# Altium schematic sheet BoardDiagramEntryConn.SchDoc: Board Diagram Entry Connection
size A3; Author: NeoExiZ; CompanyName: BUPT CPS Lab; Engineer: NeoExiZ; Organization: NeoExiZ; Address1: 418, 4#Building,BUPT; Address2: No.10, Xitucheng Road; Address3: Beijing; Address4: China
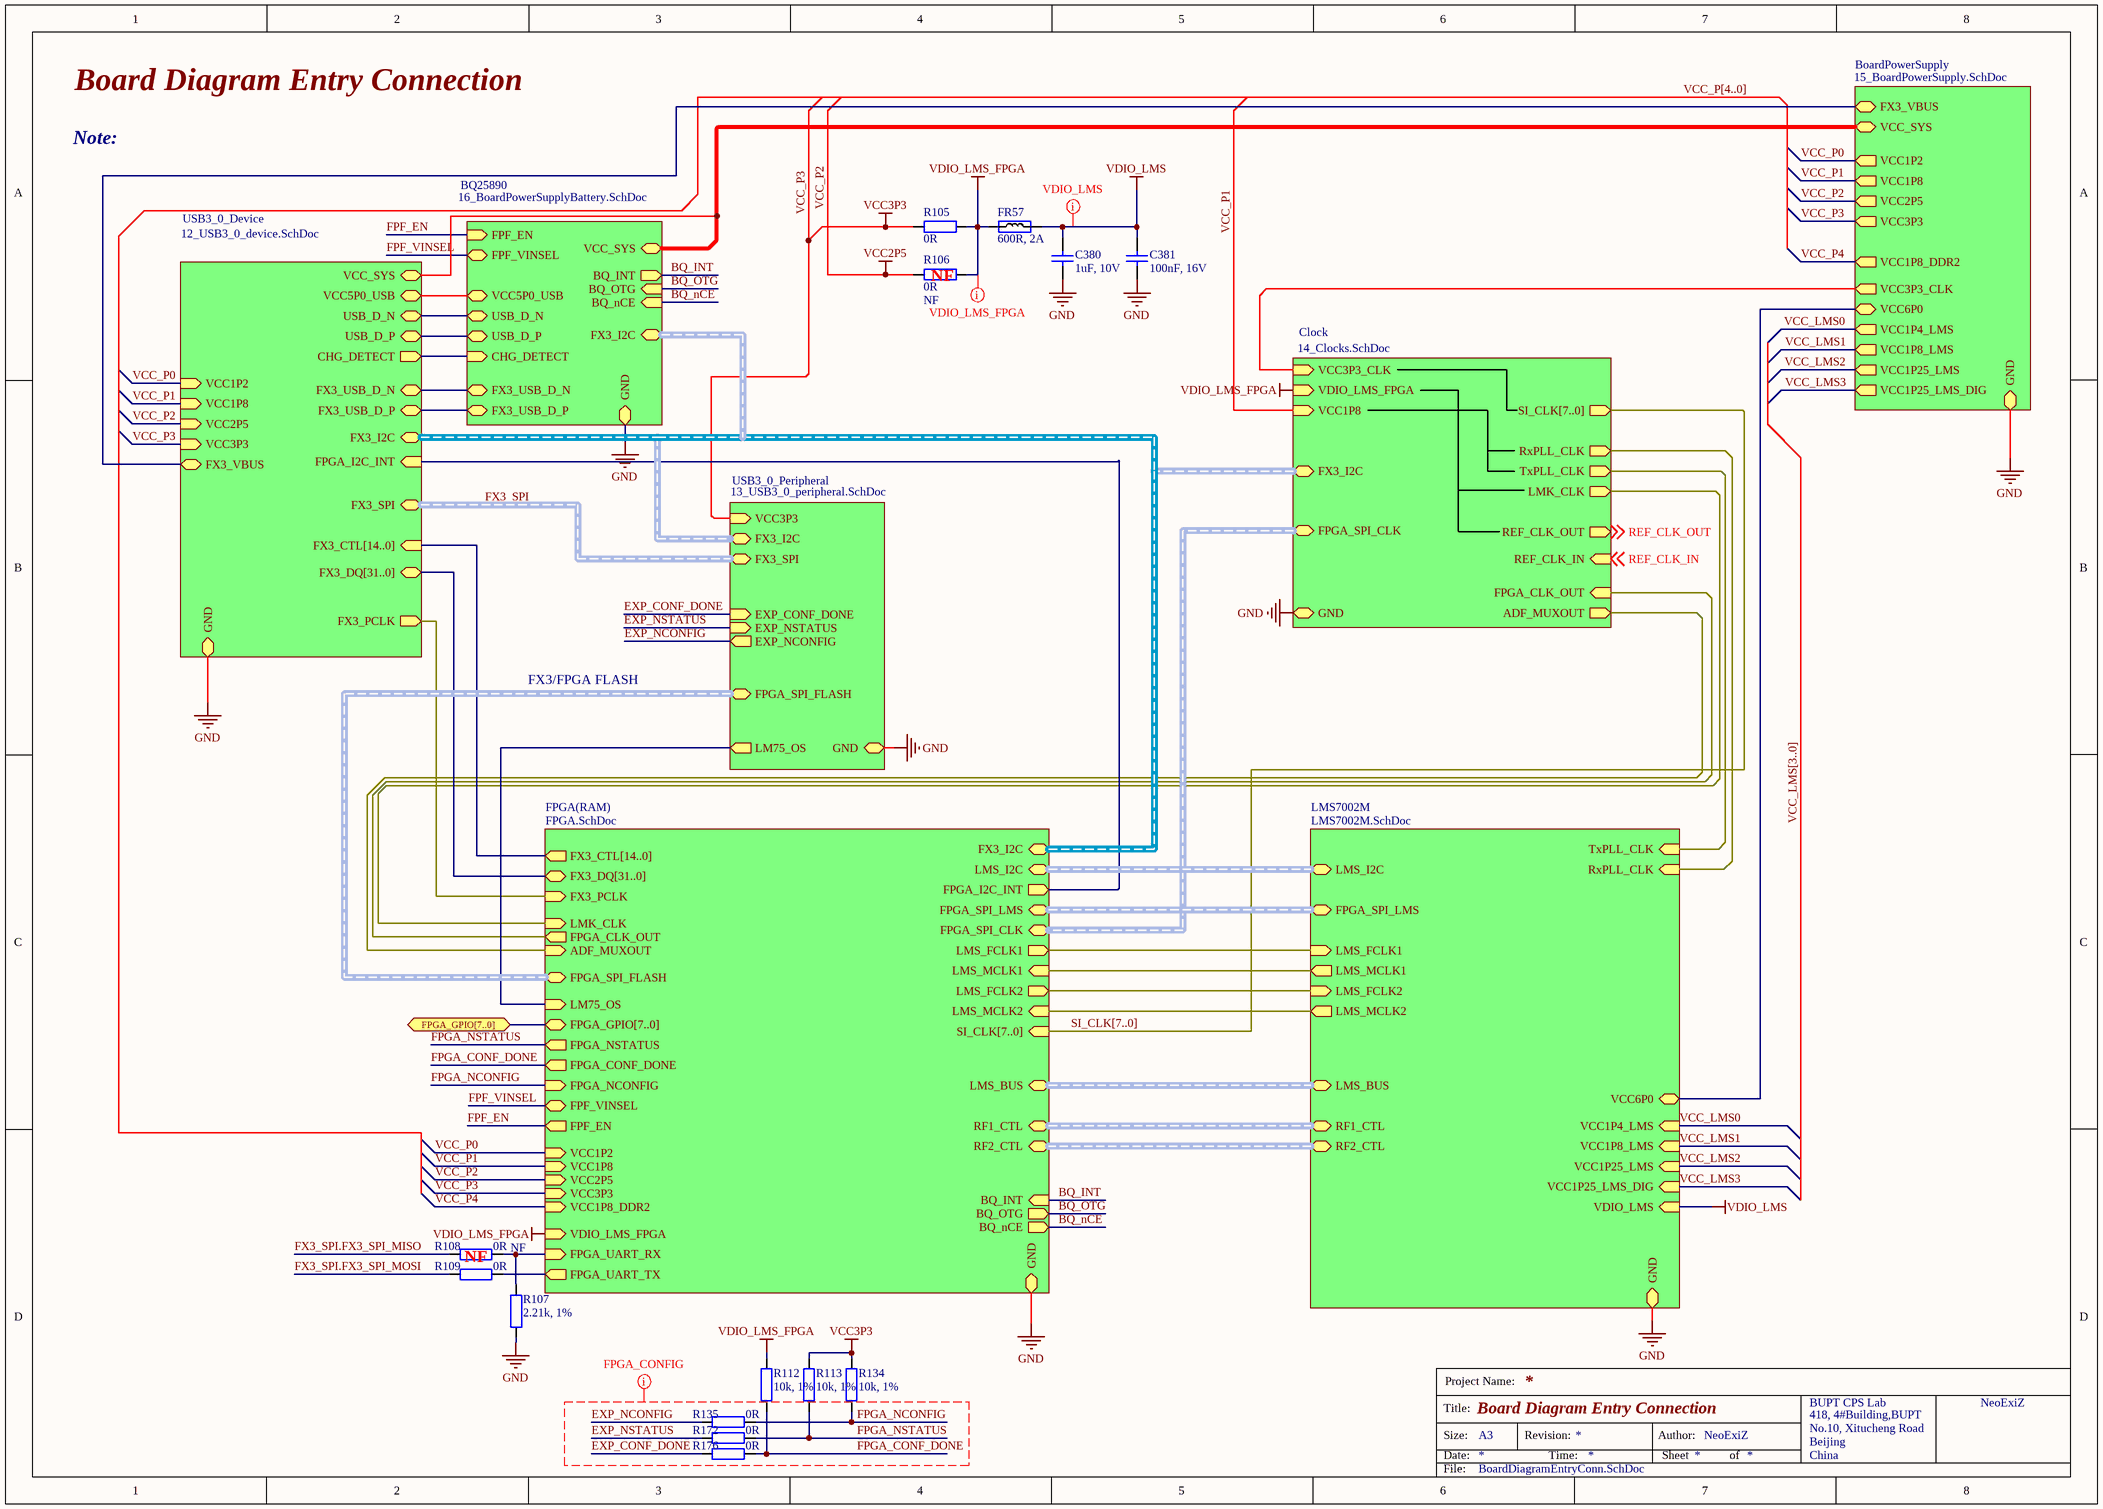
[diagram p0: BoardDiagramEntryConn.SchDoc]

## Parts
C380  1uF, 10V  [CAP0402]
C381  100nF, 16V  [CAP0402]
FR57  600R, 2A  [RES0805]
R105  0R  [RES0402]
R106  0R  Assembly Info: NF  [RES0402]
R107  2.21k, 1%  [RES0402]
R108  0R  Assembly Info: NF  [RES0402]
R109  0R  [RES0402]
R112  10k, 1%  [RES0402]
R113  10k, 1%  [RES0402]
R134  10k, 1%  [RES0402]
R135  0R  [RES0402]
R172  0R  [RES0402]
R176  0R  [RES0402]

## Sub-sheets
BoardPowerSupply = 15_BoardPowerSupply.SchDoc: VCC3P3 (out), VCC2P5 (out), VCC1P2 (out), VCC3P3_CLK (out), VCC1P4_LMS (out), VCC1P8_LMS (out), VCC1P25_LMS (out), VCC1P25_LMS_DIG (out), VCC1P8 (out), VCC1P8_DDR2 (out), VCC_SYS, GND, FX3_VBUS, VCC6P0
BQ25890 = 16_BoardPowerSupplyBattery.SchDoc: VCC5P0_USB, FX3_USB_D_N (bidir), FX3_USB_D_P (bidir), USB_D_N (bidir), USB_D_P (bidir), VCC_SYS, FPF_VINSEL (bidir), GND, BQ_nCE (in), BQ_INT (out), BQ_OTG (in), CHG_DETECT (in), FPF_EN (in), FX3_I2C (harness FX3_I2C)
Clock = 14_Clocks.SchDoc: VDIO_LMS_FPGA (in), VCC3P3_CLK (in), VCC1P8 (in), REF_CLK_IN (in), REF_CLK_OUT (out), SI_CLK[7..0] (out), RxPLL_CLK (out), TxPLL_CLK (out), FPGA_CLK_OUT (in), LMK_CLK (out), ADF_MUXOUT (out), GND, FPGA_SPI_CLK (harness FPGA_SPI_CLK), FX3_I2C (harness FX3_I2C)
FPGA(RAM) = FPGA.SchDoc: SI_CLK[7..0] (in), FX3_DQ[31..0] (bidir), FX3_PCLK (in), FX3_CTL[14..0] (out, harness FX3_SPI), LMS_MCLK1 (in), LMS_MCLK2 (in), FPGA_NSTATUS (out), FPGA_CONF_DONE (out), FPGA_NCONFIG (in), LMS_FCLK1 (out), LMS_FCLK2 (out), FPGA_I2C_INT (out), LMK_CLK (in), FPGA_CLK_OUT (out), LM75_OS (in), FPGA_GPIO[7..0] (bidir), VCC1P2 (in), VCC1P8 (in), VCC3P3 (in), VDIO_LMS_FPGA (in), VCC2P5 (in), FPGA_UART_RX (in), FPGA_UART_TX (out), ADF_MUXOUT (in), VCC1P8_DDR2 (in), FPF_VINSEL (bidir), GND, BQ_INT (in), BQ_OTG (out), BQ_nCE (out), FPF_EN (out), FPGA_SPI_CLK (harness FPGA_SPI_CLK), FX3_I2C (harness FX3_I2C), FPGA_SPI_FLASH (harness FPGA_SPI_FLASH), FPGA_SPI_LMS (harness FPGA_SPI_LMS), LMS_I2C (harness I2C), LMS_BUS (harness LMS_BUS), RF1_CTL (harness RF_CTL), RF2_CTL (harness RF_CTL)
LMS7002M = LMS7002M.SchDoc: FPGA_SPI_LMS (harness FPGA_SPI_LMS), LMS_FCLK1 (in), LMS_FCLK2 (in), LMS_MCLK1 (out), LMS_MCLK2 (out), RxPLL_CLK (in), TxPLL_CLK (in), VCC1P4_LMS (in), VCC1P8_LMS (in), VCC1P25_LMS (in), VCC1P25_LMS_DIG (in), VDIO_LMS (in), GND, LMS_I2C (harness I2C), LMS_BUS (harness LMS_BUS), RF1_CTL (harness RF_CTL), RF2_CTL (harness RF_CTL), VCC6P0
USB3_0_Device = 12_USB3_0_device.SchDoc: VCC1P2 (in), VCC1P8 (in), VCC2P5 (in), VCC3P3 (in), FX3_CTL[14..0] (in, harness FX3_SPI), FX3_DQ[31..0] (bidir), FX3_PCLK (out), FX3_USB_D_N (bidir), FX3_USB_D_P (bidir), VCC5P0_USB, USB_D_N (bidir), USB_D_P (bidir), GND, VCC_SYS, CHG_DETECT (out), FPGA_I2C_INT (in), FX3_I2C (harness FX3_I2C), FX3_SPI (harness FX3_SPI), FX3_VBUS
USB3_0_Peripheral = 13_USB3_0_peripheral.SchDoc: EXP_NCONFIG (out), EXP_NSTATUS (in), EXP_CONF_DONE (in), LM75_OS (out), VCC3P3 (in), GND, FX3_I2C (harness FX3_I2C), FPGA_SPI_FLASH (harness FPGA_SPI_FLASH), FX3_SPI (harness FX3_SPI)

## Ports
FPGA_GPIO[7..0] (bidir)

## Nets
GND: C380.1 C381.2 R107.1 ; sheet BoardPowerSupply/GND, sheet BQ25890/GND, sheet Clock/GND, sheet USB3_0_Device/GND, sheet USB3_0_Peripheral/GND, sheet FPGA(RAM)/GND, sheet LMS7002M/GND
VCC_P2: R106.2 ; sheet BoardPowerSupply/VCC2P5, sheet USB3_0_Device/VCC2P5, sheet FPGA(RAM)/VCC2P5  [also labelled VCC2P5]
VCC_P3: R105.2 R113.1 R134.1 ; sheet BoardPowerSupply/VCC3P3, sheet USB3_0_Device/VCC3P3, sheet USB3_0_Peripheral/VCC3P3, sheet FPGA(RAM)/VCC3P3  [also labelled VCC3P3]
VDIO_LMS: C380.2 C381.1 FR57.2 ; sheet LMS7002M/VDIO_LMS
VDIO_LMS_FPGA: FR57.1 R105.1 R106.1 R112.1 ; sheet Clock/VDIO_LMS_FPGA, sheet FPGA(RAM)/VDIO_LMS_FPGA
BQ_INT: sheet BQ25890/BQ_INT, sheet FPGA(RAM)/BQ_INT
BQ_nCE: sheet BQ25890/BQ_nCE, sheet FPGA(RAM)/BQ_nCE
BQ_OTG: sheet BQ25890/BQ_OTG, sheet FPGA(RAM)/BQ_OTG
EXP_CONF_DONE: R176.1 ; sheet USB3_0_Peripheral/EXP_CONF_DONE
EXP_NCONFIG: R135.1 ; sheet USB3_0_Peripheral/EXP_NCONFIG
EXP_NSTATUS: R172.1 ; sheet USB3_0_Peripheral/EXP_NSTATUS
FPF_EN: sheet BQ25890/FPF_EN, sheet FPGA(RAM)/FPF_EN
FPF_VINSEL: sheet BQ25890/FPF_VINSEL, sheet FPGA(RAM)/FPF_VINSEL
FPGA_CONF_DONE: R112.2 R176.2 ; sheet FPGA(RAM)/FPGA_CONF_DONE
FPGA_NCONFIG: R134.2 R135.2 ; sheet FPGA(RAM)/FPGA_NCONFIG
FPGA_NSTATUS: R113.2 R172.2 ; sheet FPGA(RAM)/FPGA_NSTATUS
FX3_SPI.FX3_SPI_MISO: R108.1
FX3_SPI.FX3_SPI_MOSI: R109.1
REF_CLK_IN: off-sheet REF_CLK_IN, sheet Clock/REF_CLK_IN
REF_CLK_OUT: off-sheet REF_CLK_OUT, sheet Clock/REF_CLK_OUT
VCC_LMS0: sheet BoardPowerSupply/VCC1P4_LMS, sheet LMS7002M/VCC1P4_LMS
VCC_LMS1: sheet BoardPowerSupply/VCC1P8_LMS, sheet LMS7002M/VCC1P8_LMS
VCC_LMS2: sheet BoardPowerSupply/VCC1P25_LMS, sheet LMS7002M/VCC1P25_LMS
VCC_LMS3: sheet BoardPowerSupply/VCC1P25_LMS_DIG, sheet LMS7002M/VCC1P25_LMS_DIG
VCC_P0: sheet BoardPowerSupply/VCC1P2, sheet USB3_0_Device/VCC1P2, sheet FPGA(RAM)/VCC1P2
VCC_P1: sheet BoardPowerSupply/VCC1P8, sheet Clock/VCC1P8, sheet USB3_0_Device/VCC1P8, sheet FPGA(RAM)/VCC1P8
VCC_P4: sheet BoardPowerSupply/VCC1P8_DDR2, sheet FPGA(RAM)/VCC1P8_DDR2
NetR107_2: R107.2 R108.2 ; sheet FPGA(RAM)/FPGA_UART_RX
NetR109_2: R109.2 ; sheet FPGA(RAM)/FPGA_UART_TX
(unnamed): sheet BoardPowerSupply/VCC3P3_CLK, sheet Clock/VCC3P3_CLK
(unnamed): sheet BoardPowerSupply/VCC_SYS, sheet BQ25890/VCC_SYS, sheet USB3_0_Device/VCC_SYS
(unnamed): sheet BoardPowerSupply/FX3_VBUS, sheet USB3_0_Device/FX3_VBUS
(unnamed): sheet BoardPowerSupply/VCC6P0, sheet LMS7002M/VCC6P0
(unnamed): sheet BQ25890/VCC5P0_USB, sheet USB3_0_Device/VCC5P0_USB
(unnamed): sheet BQ25890/FX3_USB_D_N, sheet USB3_0_Device/FX3_USB_D_N
(unnamed): sheet BQ25890/FX3_USB_D_P, sheet USB3_0_Device/FX3_USB_D_P
(unnamed): sheet BQ25890/USB_D_N, sheet USB3_0_Device/USB_D_N
(unnamed): sheet BQ25890/USB_D_P, sheet USB3_0_Device/USB_D_P
(unnamed): sheet BQ25890/CHG_DETECT, sheet USB3_0_Device/CHG_DETECT
(unnamed): sheet Clock/RxPLL_CLK, sheet LMS7002M/RxPLL_CLK
(unnamed): sheet Clock/TxPLL_CLK, sheet LMS7002M/TxPLL_CLK
(unnamed): sheet Clock/FPGA_CLK_OUT, sheet FPGA(RAM)/FPGA_CLK_OUT
(unnamed): sheet Clock/LMK_CLK, sheet FPGA(RAM)/LMK_CLK
(unnamed): sheet Clock/ADF_MUXOUT, sheet FPGA(RAM)/ADF_MUXOUT
(unnamed): sheet USB3_0_Device/FX3_PCLK, sheet FPGA(RAM)/FX3_PCLK
(unnamed): sheet USB3_0_Device/FPGA_I2C_INT, sheet FPGA(RAM)/FPGA_I2C_INT
(unnamed): sheet USB3_0_Peripheral/LM75_OS, sheet FPGA(RAM)/LM75_OS
(unnamed): sheet FPGA(RAM)/LMS_MCLK1, sheet LMS7002M/LMS_MCLK1
(unnamed): sheet FPGA(RAM)/LMS_MCLK2, sheet LMS7002M/LMS_MCLK2
(unnamed): sheet FPGA(RAM)/LMS_FCLK1, sheet LMS7002M/LMS_FCLK1
(unnamed): sheet FPGA(RAM)/LMS_FCLK2, sheet LMS7002M/LMS_FCLK2

## Buses and harness runs
bus port FPGA_GPIO[7..0] = sheet FPGA(RAM)/FPGA_GPIO[7..0]
bus sheet FPGA(RAM)/FX3_DQ[31..0] = sheet USB3_0_Device/FX3_DQ[31..0]
bus SI_CLK[7..0] = sheet Clock/SI_CLK[7..0] = sheet FPGA(RAM)/SI_CLK[7..0]
bus VCC_LMS[3..0]
bus VCC_P[4..0]
harness FX3_SPI = sheet USB3_0_Device/FX3_SPI = sheet USB3_0_Peripheral/FX3_SPI
harness sheet BQ25890/FX3_I2C = sheet Clock/FX3_I2C = sheet FPGA(RAM)/FX3_I2C = sheet USB3_0_Device/FX3_I2C = sheet USB3_0_Peripheral/FX3_I2C
harness sheet Clock/FPGA_SPI_CLK = sheet FPGA(RAM)/FPGA_SPI_CLK
harness sheet FPGA(RAM)/FPGA_SPI_FLASH = sheet USB3_0_Peripheral/FPGA_SPI_FLASH
harness sheet FPGA(RAM)/FPGA_SPI_LMS = sheet LMS7002M/FPGA_SPI_LMS
harness sheet FPGA(RAM)/LMS_BUS = sheet LMS7002M/LMS_BUS
harness sheet FPGA(RAM)/LMS_I2C = sheet LMS7002M/LMS_I2C
harness sheet FPGA(RAM)/RF1_CTL = sheet LMS7002M/RF1_CTL
harness sheet FPGA(RAM)/RF2_CTL = sheet LMS7002M/RF2_CTL

## Layout directives
net class FPGA_CONFIG: EXP_CONF_DONE, EXP_NCONFIG, EXP_NSTATUS, FPGA_CONF_DONE, FPGA_NCONFIG, FPGA_NSTATUS
net class VDIO_LMS: VDIO_LMS
net class VDIO_LMS_FPGA: VDIO_LMS_FPGA

## Notes on the sheet
- (near R106) NF
- FX3/FPGA FLASH
- (near R108) NF
- Note:
- Project Name:
- Size:
- Date:
- Title:
- A3
- Revision:
- Time:
- Author:
- Sheet
- of
- File:

## Library data of the parts
C380 = Cap_0402: Manufacturer Part Number 1: GRM155R61A105KE15J; Manufacturer: TDK; Part Description: 1µF ±10% 10V X5R Ceramic Capacitor -55°C ~ 85°C Surface Mount, MLCC 0402 (1005 Metric) 0.039" L x 0.020" W (1.00mm x 0.50mm); Voltage Rating: 10; Capacitance Tolerance: ± 10%; Product Range: TDK - C Series; Ceramic Capacitor Case: 0402 [1005 Metric]; Capacitance: 1; Dielectric Characteristic: X6; Value: 1uF, 10V; Supplier 1: Newark; Supplier Part Number 1: 490-6298-2-ND; MSL: -; RoHS: YES
C381 = Cap_0402: Manufacturer: Murata Electronics; Manufacturer Part Number: GRM155R71C104KA88D; Part Description: 0.10µF ±10% 16V X7R Ceramic Capacitor -55°C ~ 125°C Surface Mount, MLCC 0402 (1005 Metric) 0.039" L x 0.020" W (1.00mm x 0.50mm); Tolerance: 10 %; Type: General Purpose MLCC; Capacitance: 0.1 uF; Case Length: 1 mm; Dielectric: X7R; Case Height: 0.5 mm; Temperature Coefficient / Code: +/- 15 %; Value: 100nF, 16V; Supplier 1: Mouser; Supplier Part Number 1: 81-GRM155R71C104KA88; Case Code - in: 0402; RoHS: RoHS Compliant; Operating Temperature Range: - 55 C to + 125 C; Series: GRM; Termination Style: SMD/SMT; Package / Case: 0402 (1005 metric); Voltage Rating DC: 16 V; Maximum Operating Temperature: + 125 C; Case Code - mm: 1005; Minimum Operating Temperature: - 55 C; Product Category: Low & Medium Capacitance SMD Ceramic Chip Capacitors; Packaging: Reel; Product: General Type MLCCs; Category: Multilayer Ceramic Capacitors MLCC - SMD/SMT; Brand: Murata Electronics; Case Width: 0.5 mm; RoHS - Mouser: Y; Standard Pack Qty: 10000; Minimum Order Quantity: 1; Reeling: True; Manufacturer Part Number 1: GRM155R71C104KA88D
FR57 = Ferrite: Manufacturer Part Number 1: MPZ2012S601AT000; Manufacturer: TDK Corporation; Part Description: FERRITE BEAD 600 OHM 0805 1LN; Filter Type: Differential Mode - Single; Impedance @ Frequency: 600 Ohm @ 100MHz; DC Resistance (DCR): 100 mOhm Max; Supplier 1: Digi-Key; Supplier Part Number 1: 445-2206-2-ND; Mounting Type: Surface Mount; RoHS: RoHS Compliant; Height (Max): 0.041" (1.05mm); Packaging: Tape & Reel (TR); Category: Filters; Current Rating: 2A; Package / Case: 0805 (2012 Metric); Size / Dimension: 0.079" L x 0.049" W (2.00mm x 1.25mm); Value: 600R, 2A
R105 R106 = Res_0402: Manufacturer Part Number 1: RC0402JR-070RL; Manufacturer: Yageo; Part Description: RES SMD 0.0OHM JUMPER 1/16W 0402; Resistance (Ohms): 0.0; Tolerance: Jumper; Power (Watts): 0.063W, 1/16W; Value: 0R; Supplier 1: Digi-Key; Supplier Part Number 1: 311-0.0JRTR-ND; Category: Resistors; Temperature Coefficient: -; Features: Moisture Resistant; Supplier Device Package: 0402; Height: 0.016" (0.40mm); Package / Case: 0402 (1005 Metric); Operating Temperature: -55°C ~ 155°C; Size / Dimension: 0.039" L x 0.020" W (1.00mm x 0.50mm); Composition: Thick Film; Packaging: Tape & Reel (TR); Number of Terminations: 2; RoHS: RoHS Compliant
R107 = Res_0402: Manufacturer: Stackpole Electronics Inc.; Manufacturer Part Number 1: RMCF0402FT2K21; Part Description: RES SMD 2.21K OHM 1% 1/16W 0402; Power (Watts): 0.063W, 1/16W; Temperature Coefficient: ±100ppm/°C; Value: 2.21k, 1%; Supplier 1: Digi-Key; Supplier Part Number 1: RMCF0402FT2K21CT-ND; Operating Temperature: -55°C ~ 155°C; Height: 0.016" (0.40mm); Tolerance: ±1%; Resistance (Ohms): 2.21k; Features: Automotive AEC-Q200; Package / Case: 0402 (1005 Metric); Packaging: Cut Tape (CT); Composition: Thick Film; Category: Resistors; Supplier Device Package: 0402; Number of Terminations: 2; RoHS: RoHS Compliant; Size / Dimension: 0.039" L x 0.020" W (1.00mm x 0.50mm)
R108 R109 R135 R172 R176 = Res_0402: Manufacturer: Yageo; Part Description: RES SMD 0.0OHM JUMPER 1/16W 0402; Supplier 1: Digi-Key; Supplier Part Number 1: 311-0.0JRTR-ND; Composition: Thick Film; Package / Case: 0402 (1005 Metric); Category: Resistors; Value: 0R
R112 R113 R134 = Res_0402: Manufacturer: Yageo; Manufacturer Part Number 1: RC0402FR-0710KL; Part Description: RES SMD 10K OHM 1% 1/16W 0402; Temperature Coefficient: ±100ppm/°C; Power (Watts): 0.063W, 1/16W; Value: 10k, 1%; Supplier 1: Digi-Key; Supplier Part Number 1: 311-10.0KLRTR-ND; Resistance (Ohms): 10k; Packaging: Tape & Reel (TR); RoHS: RoHS Compliant; Package / Case: 0402 (1005 Metric); Tolerance: ±1%; Operating Temperature: -55°C ~ 155°C; Size / Dimension: 0.039" L x 0.020" W (1.00mm x 0.50mm); Number of Terminations: 2; Category: Resistors; Height: 0.016" (0.40mm); Supplier Device Package: 0402; Features: Moisture Resistant; Composition: Thick Film